# Altium schematic sheet F030EVM.SchDoc
size A4
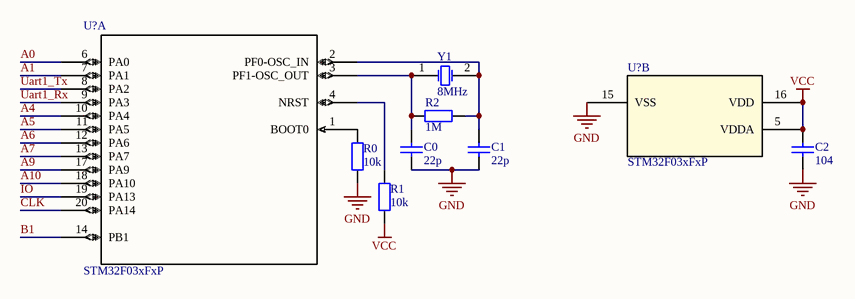
[diagram p0: F030EVM.SchDoc]

## Parts
(Parts that share a designator on the sheet are numbered #1, #2 ... from top to bottom, then left to right.)
C0  22p  [0805]
C1  22p  [0805]
C2  104  [0805]
R0  10k  [0805]
R1  10k  [0805]
R2  1M  [0805]
U?#1  STM32F03xFxP  [TSSOP20]  (part A of 2)
U?#2  STM32F03xFxP  [TSSOP20]  (part B of 2)
Y1  8MHz  [3215-2]

## Nets
GND: C0.1 C1.1 C2.1 R0.1 U?#2.15(VSS)
VCC: C2.2 R1.1 U?#2.5(VDDA) U?#2.16(VDD)
A0: U?#1.6(PA0)
A1: U?#1.7(PA1)
A4: U?#1.10(PA4)
A5: U?#1.11(PA5)
A6: U?#1.12(PA6)
A7: U?#1.13(PA7)
A9: U?#1.17(PA9)
A10: U?#1.18(PA10)
B1: U?#1.14(PB1)
CLK: U?#1.20(PA14)
IO: U?#1.19(PA13)
Uart1_Rx: U?#1.9(PA3)
Uart1_Tx: U?#1.8(PA2)
NetC0_2: C0.2 R2.1 U?#1.3(PF1-OSC_OUT) Y1.1(OSC1)
NetC1_2: C1.2 R2.2 U?#1.2(PF0-OSC_IN) Y1.2(OSC2)
NetR0_2: R0.2 U?#1.1(BOOT0)
NetR1_2: R1.2 U?#1.4(NRST)

## Library data of the parts
C0-C2 = C: Capacitor; Published: 8-Jun-2000; LatestRevisionDate: 17-Jul-2002; LatestRevisionNote: Re-released for DXP Platform.; PackageReference: RAD-0.3; Publisher: Altium Limited; PackageDescription: Radial Cap, Thru-Hole; 2 Leads; 0.3 in Pin Spacing
R0-R2 = R: Resistor; Published: 8-Jun-2000; LatestRevisionDate: 17-Jul-2002; LatestRevisionNote: Re-released for DXP Platform.; PackageReference: AXIAL-0.4; Publisher: Altium Limited; PackageDescription: Axial Device, Thru-Hole; 2 Leads; 0.4 in Pin Spacing
U?#1 U?#2 = STM32F03xFxP: Mcu; Vendor: STMicroelectronics; C: Copyright (C) 2016 Accelerated Designs. All rights reserved; Copyright: Copyright (C) 2016 Accelerated Designs. All rights reserved; Manufacturer_Part_Number: stm32f03xfxp; RefDes: RefDes; Type: Type; Value: Value
Y1 = XTAL: Crystal Oscillator; Published: 8-Jun-2000; LatestRevisionDate: 17-Jul-2002; LatestRevisionNote: Re-released for DXP Platform.; Publisher: Altium Limited